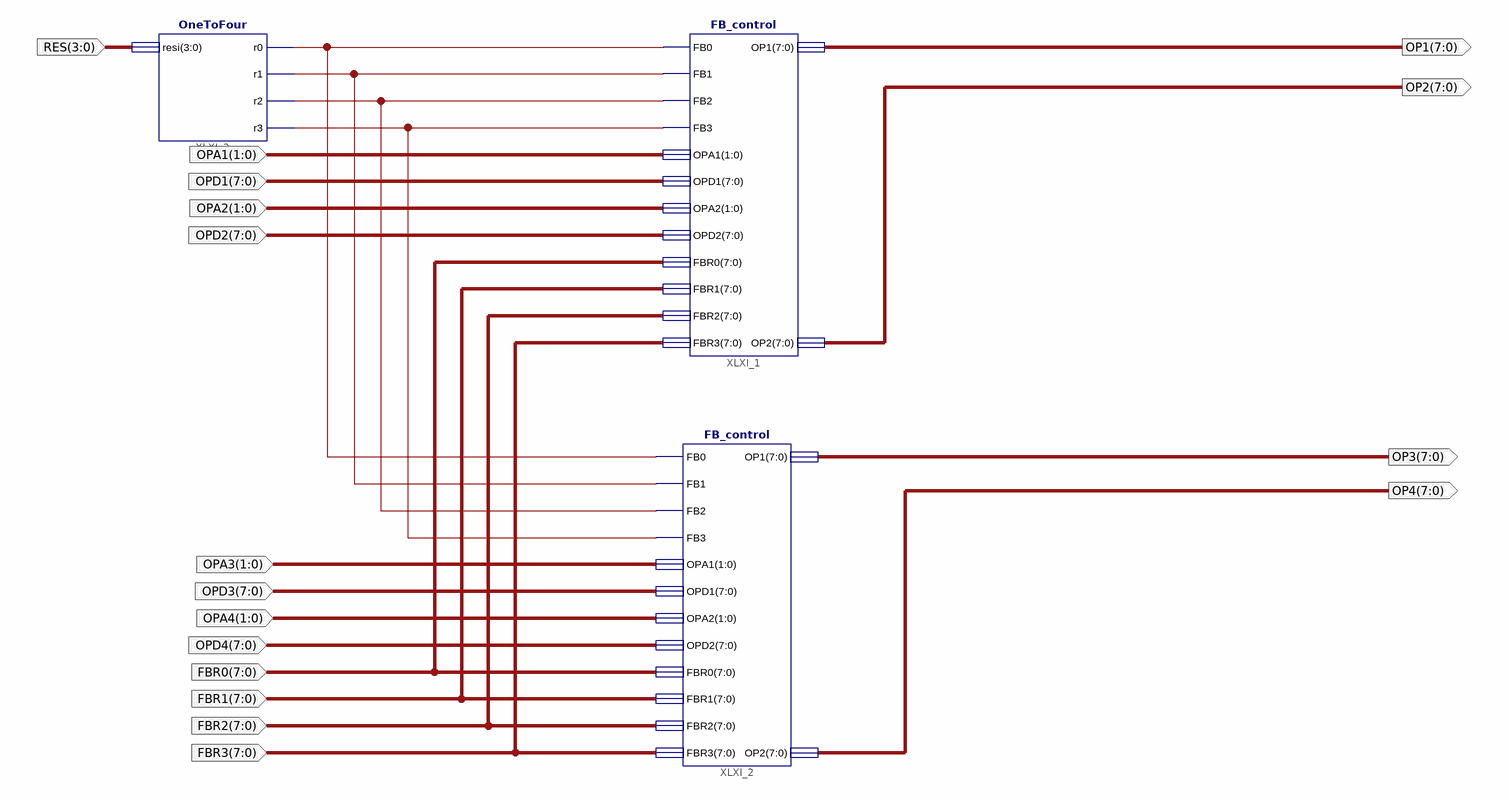
[diagram p0: schematic sheet 1]
// Xilinx ISE schematic Double_FB_Control.sch (spartan3) as structural Verilog: 3 symbols, 17 ports
module Double_FB_Control (
  input  [7:0] FBR2,
  input  [7:0] FBR1,
  input  [7:0] FBR0,
  input  [7:0] FBR3,
  input  [1:0] OPA1,
  input  [7:0] OPD1,
  input  [1:0] OPA2,
  input  [7:0] OPD2,
  input  [1:0] OPA3,
  input  [7:0] OPD3,
  input  [1:0] OPA4,
  input  [7:0] OPD4,
  input  [3:0] RES,
  output [7:0] OP1,
  output [7:0] OP2,
  output [7:0] OP3,
  output [7:0] OP4
);

  wire FB0, FB1, FB2, FB3;

  FB_control XLXI_1 (
    .FB0(FB0), .FB1(FB1), .FB2(FB2), .FB3(FB3), .OPA1(OPA1), .OPD1(OPD1), .OPA2(OPA2), .OPD2(OPD2),
    .FBR0(FBR0), .FBR1(FBR1), .FBR2(FBR2), .FBR3(FBR3), .OP1(OP1), .OP2(OP2));
  FB_control XLXI_2 (
    .FB0(FB0), .FB1(FB1), .FB2(FB2), .FB3(FB3), .OPA1(OPA3), .OPD1(OPD3), .OPA2(OPA4), .OPD2(OPD4),
    .FBR0(FBR0), .FBR1(FBR1), .FBR2(FBR2), .FBR3(FBR3), .OP1(OP3), .OP2(OP4));
  OneToFour XLXI_3 (.resi(RES), .r0(FB0), .r1(FB1), .r2(FB2), .r3(FB3));
endmodule
